# EAGLE design untitled (EAGLE 9.3.1)
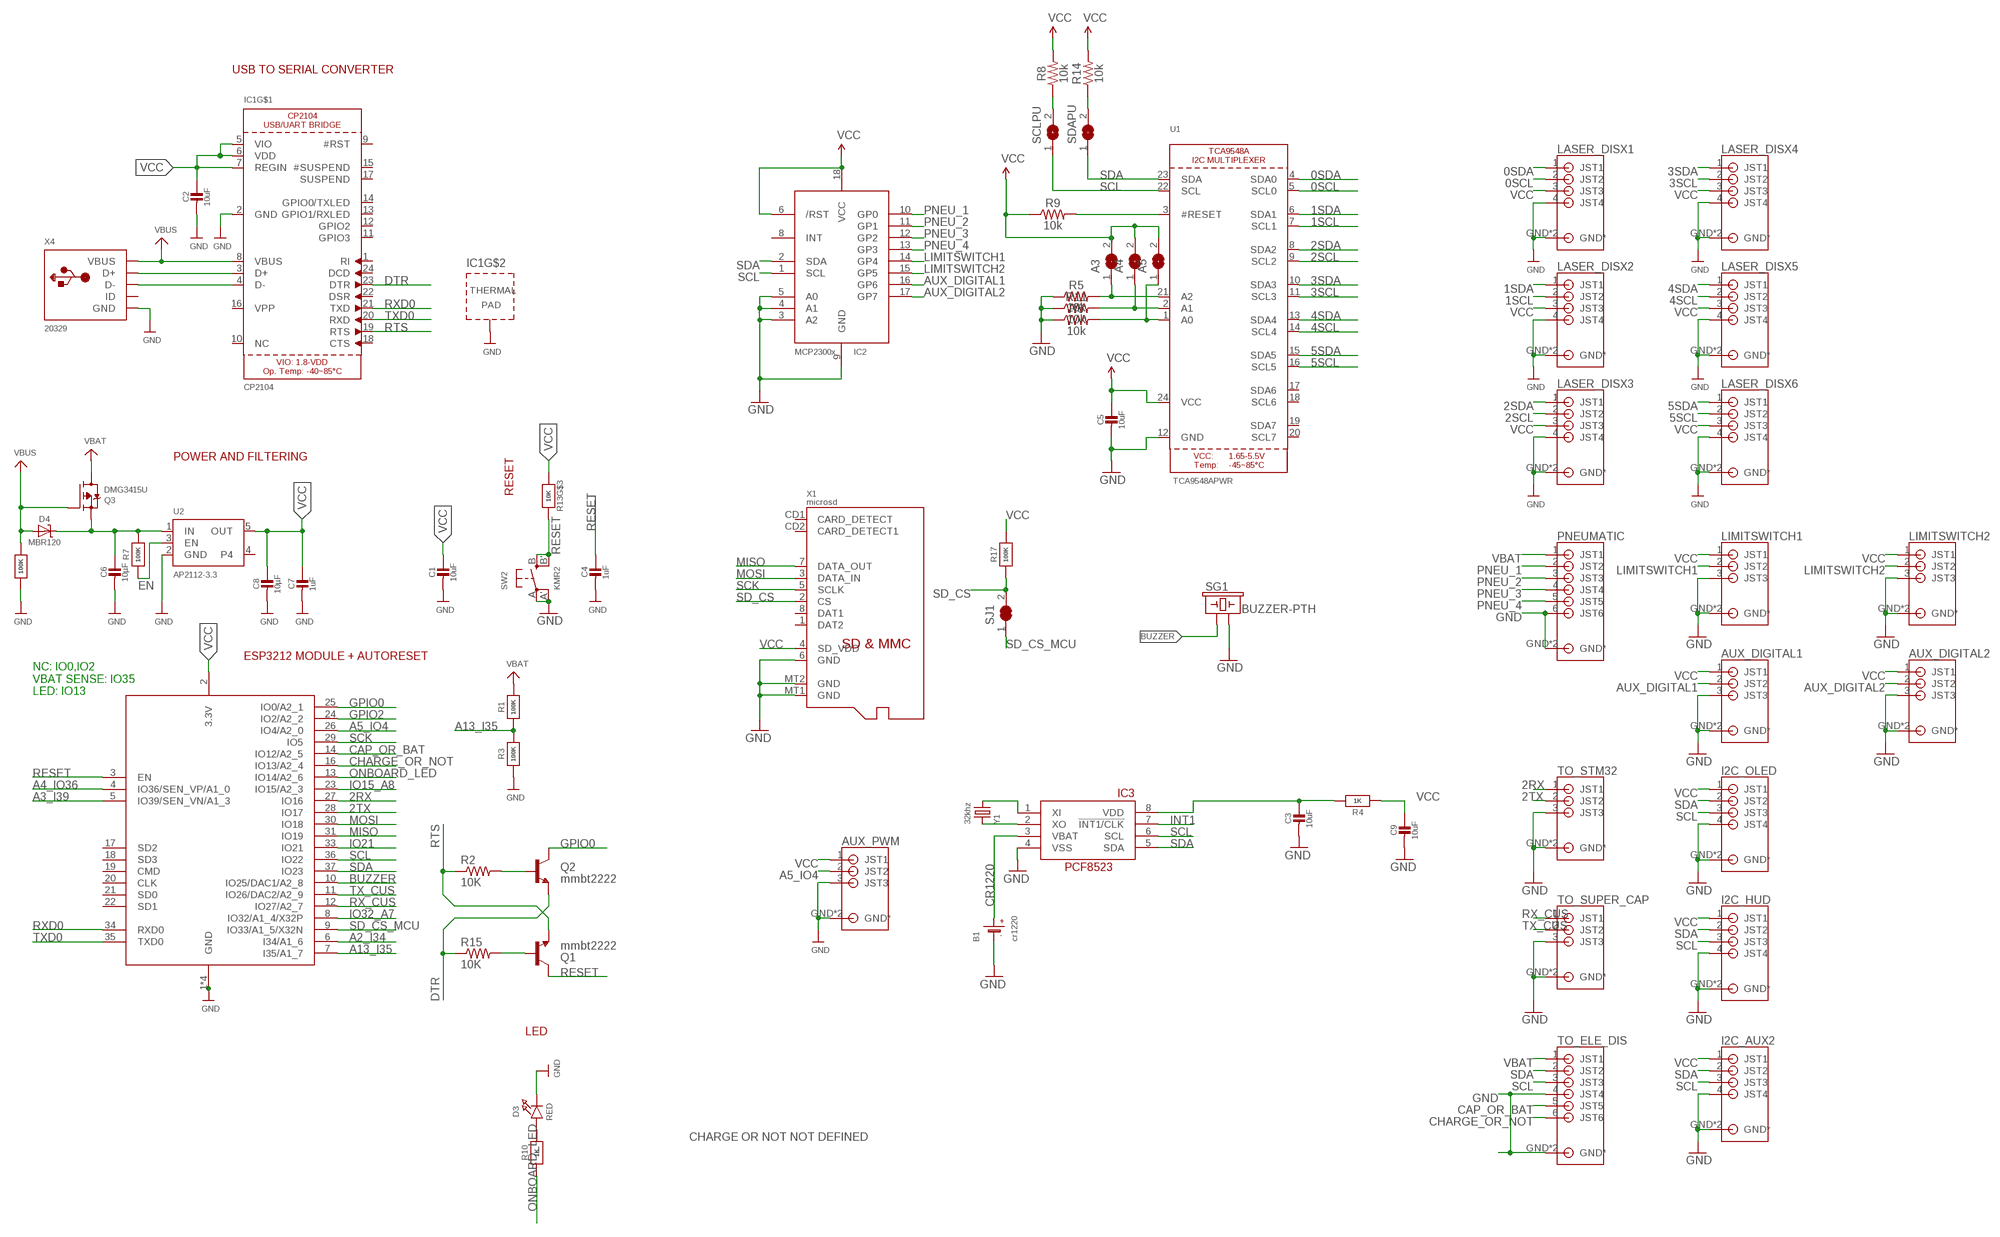
[diagram p0: schematic, sheet 1]

## Parts
A3  SOLDERJUMPER  [SOLDERJUMPER_ARROW_NOPASTE]
A4  SOLDERJUMPER  [SOLDERJUMPER_ARROW_NOPASTE]
A5  SOLDERJUMPER  [SOLDERJUMPER_ARROW_NOPASTE]
AUX_DIGITAL1  S3B-PH-SM4_TB  [S3B-PH-SM4_TB]
AUX_DIGITAL2  S3B-PH-SM4_TB  [S3B-PH-SM4_TB]
AUX_PWM  S3B-PH-SM4_TB  [S3B-PH-SM4_TB]
B1  cr1220  BATTERYCR1220_2  [CR1220-2]
C1  10uF  CAP_CERAMIC0805-NOOUTLINE  [0805-NO]
C2  10uF  CAP_CERAMIC0805-NOOUTLINE  [0805-NO]
C3  10uF  CAP_CERAMIC0805-NOOUTLINE  [0805-NO]
C4  1uF  CAP_CERAMIC0603_NO  [0603-NO]
C5  10uF  CAP_CERAMIC0805-NOOUTLINE  [0805-NO]
C6  10µF  CAP_CERAMIC0805-NOOUTLINE  [0805-NO]
C7  1uF  CAP_CERAMIC0603_NO  [0603-NO]
C8  10µF  CAP_CERAMIC0805-NOOUTLINE  [0805-NO]
C9  10uF  CAP_CERAMIC0805-NOOUTLINE  [0805-NO]
D3  RED  LED0805_NOOUTLINE  [CHIPLED_0805_NOOUTLINE]
D4  MBR120  DIODE-SCHOTTKYSOD-123  [SOD-123]
I2C_AUX2  S4B-PH-SM4_TB  [S4B-PH-SM4_TB]
I2C_HUD  S4B-PH-SM4_TB  [S4B-PH-SM4_TB]
I2C_OLED  S4B-PH-SM4_TB  [S4B-PH-SM4_TB]
IC1  CP2104  [QFN24_4MM_SMSC]
IC2  MCP23008/SO  [SO18W]
IC3  PCF8523T  RTC_PCF8523T  [SOIC8_150MIL]
LASER_DISX1  S4B-PH-SM4_TB  [S4B-PH-SM4_TB]
LASER_DISX2  S4B-PH-SM4_TB  [S4B-PH-SM4_TB]
LASER_DISX3  S4B-PH-SM4_TB  [S4B-PH-SM4_TB]
LASER_DISX4  S4B-PH-SM4_TB  [S4B-PH-SM4_TB]
LASER_DISX5  S4B-PH-SM4_TB  [S4B-PH-SM4_TB]
LASER_DISX6  S4B-PH-SM4_TB  [S4B-PH-SM4_TB]
LIMITSWITCH1  S3B-PH-SM4_TB  [S3B-PH-SM4_TB]
LIMITSWITCH2  S3B-PH-SM4_TB  [S3B-PH-SM4_TB]
PNEUMATIC  S6B-PH-SM4_TB  [S6B-PH-SM4_TB]
Q1  mmbt2222  TRANSISTOR_NPNSOT23-3  [SOT23-3]
Q2  mmbt2222  TRANSISTOR_NPNSOT23-3  [SOT23-3]
Q3  DMG3415U  MOSFET-P  [SOT23-R]
R1  100K  RESISTOR_0603_NOOUT  [0603-NO]
R2  10K  10KOHM-1/10W-1%(0603)0603  [0603-RES]
R3  100K  RESISTOR_0603_NOOUT  [0603-NO]
R4  1K  RESISTOR_0603_NOOUT  [0603-NO]
R5  10k  10KOHM-0603-1/10W-1%  [0603]
R6  10k  10KOHM-0603-1/10W-1%  [0603]
R7  100K  RESISTOR_0603_NOOUT  [0603-NO]
R8  10k  10KOHM-0603-1/10W-1%  [0603]
R9  10k  10KOHM-0603-1/10W-1%  [0603]
R10  1K  RESISTOR_0603_NOOUT  [0603-NO]
R11  10k  10KOHM-0603-1/10W-1%  [0603]
R12  100K  RESISTOR_0603_NOOUT  [0603-NO]
R13  10K  RESISTOR_4PACK  [RESPACK_4X0603]
R14  10k  10KOHM-0603-1/10W-1%  [0603]
R15  10K  10KOHM-1/10W-1%(0603)0603  [0603-RES]
R17  100K  RESISTOR_0603_NOOUT  [0603-NO]
SCLPU  SOLDERJUMPERCLOSED  [SOLDERJUMPER_CLOSEDWIRE]
SDAPU  SOLDERJUMPERCLOSED  [SOLDERJUMPER_CLOSEDWIRE]
SG1  BUZZER-PTH  [BUZZER-12MM]
SJ1  SOLDERJUMPER_CLOSED  [SOLDERJUMPER_CLOSEDWIRE]
SW2  KMR2  SWITCH_TACT_SMT4.6X2.8  [BTN_KMR2_4.6X2.8]
TO_ELE_DIS  S6B-PH-SM4_TB  [S6B-PH-SM4_TB]
TO_STM32  S3B-PH-SM4_TB  [S3B-PH-SM4_TB]
TO_SUPER_CAP  S3B-PH-SM4_TB  [S3B-PH-SM4_TB]
U1  TCA9548APWR  TCA9548A  [TSSOP24]
U2  AP2112-3.3  VREG_SOT23-5  [SOT23-5]
X1  microsd  MICROSD  [MICROSD]
X2  ESP32_WROOM32_SKINNY  [WROOM32_SKINNY]
X4  20329  USB_MICRO_20329_V2  [4UCONN_20329_V2]
Y1  32khz  CRYSTAL8.0X3.8  [CRYSTAL_8X3.8]

## Nets
0SCL: LASER_DISX1.2(JST2) U1.5(SCL0)
0SDA: LASER_DISX1.1(JST1) U1.4(SDA0)
1SCL: LASER_DISX2.2(JST2) U1.7(SCL1)
1SDA: LASER_DISX2.1(JST1) U1.6(SDA1)
2RX [sig]: TO_STM32.1(JST1) X2.27(IO16)
2SCL: LASER_DISX3.2(JST2) U1.9(SCL2)
2SDA: LASER_DISX3.1(JST1) U1.8(SDA2)
2TX [sig]: TO_STM32.2(JST2) X2.28(IO17)
3SCL: LASER_DISX4.2(JST2) U1.11(SCL3)
3SDA: LASER_DISX4.1(JST1) U1.10(SDA3)
4SCL: LASER_DISX5.2(JST2) U1.14(SCL4)
4SDA: LASER_DISX5.1(JST1) U1.13(SDA4)
5SCL: LASER_DISX6.2(JST2) U1.16(SCL5)
5SDA: LASER_DISX6.1(JST1) U1.15(SDA5)
A0: A5.1 R6.2 U1.1(A0)
A1: A4.1 R11.2 U1.2(A1)
A2: A3.1 R5.2 U1.21(A2)
A2_I34 [sig]: X2.6(I34/A1_6)
A3_I39 [sig]: X2.5(IO39/SEN_VN/A1_3)
A4_IO36 [sig]: X2.4(IO36/SEN_VP/A1_0)
A5_IO4 [sig]: AUX_PWM.2(JST2) X2.26(IO4/A2_0)
A13_I35 [sig]: R1.1 R3.2 X2.7(I35/A1_7)
AUX_DIGITAL1: AUX_DIGITAL1.2(JST2) IC2.16(GP6)
AUX_DIGITAL2: AUX_DIGITAL2.2(JST2) IC2.17(GP7)
BUZZER [sig]: SG1.+ X2.10(IO25/DAC1/A2_8)
CAP_OR_BAT: TO_ELE_DIS.5(JST5) X2.14(IO12/A2_5)
CHARGE_OR_NOT: TO_ELE_DIS.6(JST6) X2.16(IO13/A2_4)
CR1220: B1.+ IC3.3(VBAT)
DTR: IC1.23(DTR) Q2.2(E) R15.1
EN: R7.1 U2.3(EN)
GND: AUX_DIGITAL1.3(JST3) AUX_DIGITAL1.GND2(GND*) AUX_DIGITAL1.GND(GND*) AUX_DIGITAL2.3(JST3) AUX_DIGITAL2.GND2(GND*) AUX_DIGITAL2.GND(GND*) AUX_PWM.3(JST3) AUX_PWM.GND2(GND*) AUX_PWM.GND(GND*) B1.- C1.2 C2.2 C3.2 C4.2 C5.2 C6.2 C7.2 C8.2 C9.2 D3.C I2C_AUX2.4(JST4) I2C_AUX2.GND2(GND*) I2C_AUX2.GND(GND*) I2C_HUD.4(JST4) I2C_HUD.GND2(GND*) I2C_HUD.GND(GND*) I2C_OLED.4(JST4) I2C_OLED.GND2(GND*) I2C_OLED.GND(GND*) IC1.2(GND) IC1.THERM(TP) IC2.3(A2) IC2.4(A1) IC2.5(A0) IC2.9(GND) IC3.4(VSS) LASER_DISX1.4(JST4) LASER_DISX1.GND2(GND*) LASER_DISX1.GND(GND*) LASER_DISX2.4(JST4) LASER_DISX2.GND2(GND*) LASER_DISX2.GND(GND*) LASER_DISX3.4(JST4) LASER_DISX3.GND2(GND*) LASER_DISX3.GND(GND*) LASER_DISX4.4(JST4) LASER_DISX4.GND2(GND*) LASER_DISX4.GND(GND*) LASER_DISX5.4(JST4) LASER_DISX5.GND2(GND*) LASER_DISX5.GND(GND*) LASER_DISX6.4(JST4) LASER_DISX6.GND2(GND*) LASER_DISX6.GND(GND*) LIMITSWITCH1.3(JST3) LIMITSWITCH1.GND2(GND*) LIMITSWITCH1.GND(GND*) LIMITSWITCH2.3(JST3) LIMITSWITCH2.GND2(GND*) LIMITSWITCH2.GND(GND*) PNEUMATIC.6(JST6) PNEUMATIC.GND2(GND*) PNEUMATIC.GND(GND*) R3.1 R5.1 R6.1 R11.1 R12.1 SG1.- SW2.A'(P1) SW2.A(P) TO_ELE_DIS.4(JST4) TO_ELE_DIS.GND2(GND*) TO_ELE_DIS.GND(GND*) TO_STM32.3(JST3) TO_STM32.GND2(GND*) TO_STM32.GND(GND*) TO_SUPER_CAP.3(JST3) TO_SUPER_CAP.GND2(GND*) TO_SUPER_CAP.GND(GND*) U1.12(GND) U2.2(GND) X1.6(GND) X1.MT1(GND) X1.MT2(GND) X2.1(GND) X2.15(GND) X2.38(GND) X2.P$1(GND) X4.BASE@1(GND) X4.BASE@2(GND) X4.GND X4.SPRT@1(GND) X4.SPRT@2(GND) X4.SPRT@3(GND) X4.SPRT@4(GND)
GPIO0: Q2.3(C) X2.25(IO0/A2_1)
GPIO2 [sig]: X2.24(IO2/A2_2)
INT1: IC3.7(!INT1/CLK)
IO15_A8 [sig]: X2.23(IO15/A2_3)
IO21 [sig]: X2.33(IO21)
IO32_A7 [sig]: X2.8(IO32/A1_4/X32P)
LIMITSWITCH1: IC2.14(GP4) LIMITSWITCH1.2(JST2)
LIMITSWITCH2: IC2.15(GP5) LIMITSWITCH2.2(JST2)
MISO [sig]: X1.7(DATA_OUT) X2.31(IO19)
MOSI [sig]: X1.3(DATA_IN) X2.30(IO18)
N$1: IC3.1(XI) Y1.P$4
N$2: IC1.3(D+) X4.D+
N$3: IC3.2(XO) Y1.P$1
N$4: C3.1 IC3.8(VDD) R4.2
N$5: D3.A R10.2
N$6: IC1.4(D-) X4.D-
N$7: C6.1 D4.C Q3.2(S) R7.2 U2.1(IN)
N$8: R8.1 SCLPU.2
N$9: R14.1 SDAPU.2
N$10: R9.2 U1.3(#RESET)
N$12: Q1.1(B) R15.2
N$13: Q2.1(B) R2.2
ONBOARD_LED [sig]: R10.1 X2.13(IO14/A2_6)
PNEU_1: IC2.10(GP0) PNEUMATIC.2(JST2)
PNEU_2: IC2.11(GP1) PNEUMATIC.3(JST3)
PNEU_3: IC2.12(GP2) PNEUMATIC.4(JST4)
PNEU_4: IC2.13(GP3) PNEUMATIC.5(JST5)
RESET [sig]: C4.1 Q1.3(C) R13.6 SW2.B'(S1) SW2.B(S) X2.3(EN)
RTS: IC1.19(RTS) Q1.2(E) R2.1
RX_CUS [sig]: TO_SUPER_CAP.1(JST1) X2.12(IO27/A2_7)
RXD0 [sig]: IC1.21(TXD) X2.34(RXD0)
SCK [sig]: X1.5(SCLK) X2.29(IO5)
SCL [sig]: I2C_AUX2.3(JST3) I2C_HUD.3(JST3) I2C_OLED.3(JST3) IC2.1(SCL) IC3.6(SCL) SCLPU.1 TO_ELE_DIS.3(JST3) U1.22(SCL) X2.36(IO22)
SD_CS: R17.1 SJ1.2 X1.2(CS)
SD_CS_MCU [sig]: SJ1.1 X2.9(IO33/A1_5/X32N)
SDA [sig]: I2C_AUX2.2(JST2) I2C_HUD.2(JST2) I2C_OLED.2(JST2) IC2.2(SDA) IC3.5(SDA) SDAPU.1 TO_ELE_DIS.2(JST2) U1.23(SDA) X2.37(IO23)
TX_CUS [sig]: TO_SUPER_CAP.2(JST2) X2.11(IO26/DAC2/A2_9)
TXD0 [sig]: IC1.20(RXD) X2.35(TXD0)
VBAT: PNEUMATIC.1(JST1) Q3.3(D) R1.2 TO_ELE_DIS.1(JST1)
VBUS: D4.A IC1.8(VBUS) Q3.1(G) R12.2 X4.VBUS
VCC: A3.2 A4.2 A5.2 AUX_DIGITAL1.1(JST1) AUX_DIGITAL2.1(JST1) AUX_PWM.1(JST1) C1.1 C2.1 C5.1 C7.1 C8.1 C9.1 I2C_AUX2.1(JST1) I2C_HUD.1(JST1) I2C_OLED.1(JST1) IC1.5(VIO) IC1.6(VDD) IC1.7(REGIN) IC2.6(/RST) IC2.18(VCC) LASER_DISX1.3(JST3) LASER_DISX2.3(JST3) LASER_DISX3.3(JST3) LASER_DISX4.3(JST3) LASER_DISX5.3(JST3) LASER_DISX6.3(JST3) LIMITSWITCH1.1(JST1) LIMITSWITCH2.1(JST1) R4.1 R8.2 R9.1 R13.3 R14.2 R17.2 U1.24(VCC) U2.5(OUT) X1.4(SD_VDD) X2.2(3.3V)
Unconnected: IC1.1(RI) IC1.9(#RST) IC1.10(NC) IC1.11(GPIO3) IC1.12(GPIO2) IC1.13(GPIO1/RXLED) IC1.14(GPIO0/TXLED) IC1.15(#SUSPEND) IC1.16(VPP) IC1.17(SUSPEND) IC1.18(CTS) IC1.22(DSR) IC1.24(DCD) IC2.8(INT) R13.1 R13.2 R13.4 R13.5 R13.7 R13.8 U1.17(SDA6) U1.18(SCL6) U1.19(SDA7) U1.20(SCL7) U2.4 X1.1(DAT2) X1.8(DAT1) X1.CD1(CARD_DETECT) X1.CD2(CARD_DETECT1) X2.17(SD2) X2.18(SD3) X2.19(CMD) X2.20(CLK) X2.21(SD0) X2.22(SD1) X4.ID

## Notes on the sheet
- USB TO SERIAL CONVERTER
- POWER AND FILTERING
- RESET
- ESP3212 MODULE + AUTORESET
- NC: IO0,IO2
  VBAT SENSE: IO35
  LED: IO13
- LED
- CHARGE OR NOT NOT DEFINED

## Library data of the parts
A3-A5 = microbuilder:SOLDERJUMPER: SMD Solder JUMPER Solder the two pads together to create a connection, or remove the solder to break it. REFLOW - Use this footprint for solder paste and reflow ovens. WAVE - Use this footprint for hand-soldering (larger pads). CLOSED - Has a trace between the two pads to ensure it is closed by default. The trace needs to be cut to disable the jumper, and can be closed again by creating a solder bridge between the two pads.; BOM: EXCLUDE
AUX_DIGITAL1 AUX_DIGITAL2 AUX_PWM LIMITSWITCH1 LIMITSWITCH2 TO_STM32 TO_SUPER_CAP = NewKevinMade:S3B-PH-SM4_TB
B1 = microbuilder:BATTERY: CR1220 SMT - Digikey: 3001K-ND CD2032 BAT-HLD-001 - Digikey: BAT-HLD-001-ND
C1-C9 = microbuilder:CAP_CERAMIC: Ceramic Capacitors For new designs, use the packages preceded by an '_' character since they are more reliable: The following footprints should be used on most boards: _0402 - Standard footprint for regular board layouts _0603 - Standard footprint for regular board layouts _0805 - Standard footprint for regular board layouts _1206 - Standard footprint for regular board layouts For extremely tight-pitch boards where space is at a premium, the following 'micro-pitch' footprints can be used (smaller pads, no silkscreen outline, etc.): _0402MP - Micro-pitch footprint for very dense/compact boards _0603MP - Micro-pitch footprint for very dense/compact boards _0805MP - Micro-pitch footprint for very dense/compact boards _1206MP - Micro-pitch footprint for very dense/compact boards
D3 = microbuilder:LED: LED 0603 - 0603 Surface Mount Package 2mA: Green LED - Low Power (3.9mcd, 2ma, 1.7Vf) - Digikey: 475-2709-2-ND Orange LED - Low Power (9.8mcd, 2ma, 1.8Vf) - Digikey: 475-1194-2-ND Red LED - Low Power (5mcd, 2ma, 1.8Vf) - Digikey: 475-1195-2-ND Yellow LED - Low Power (7mcd, 2ma, 1.8Vf) - Digikey: 475-1196-2-ND 5mA: Blue LED - Low Power (17mcd, 5ma, 2.9Vf) - Digikey: LNJ937W8CRACT-ND 0805 - 0805 Surface Mount Package 2mA: Red LED (8.8mcd, 2mA, 1.8Vf, Clear) - Low Power [Digikey: 475-2510-1-ND] Green LED (5mcd, 2mA, 1.8Vf, Clear) - Low Power [Digikey: 475-2730-1-ND] Yellow LED (11.3mcd, 2mA, 1.8Vf, Clear) - Low Power [Digikey: 475-2555-1-ND] 20mA: Red LED (104mcd, 20mA, Diffused) - LS R976 [Digikey: 475-1278-6-ND] Red LED (12mcd, 20mA, 2.0Vf, Clear) - APT2012EC [Digikey: 754-1128-1-ND] Green LED (15mcd, 20mA, 2.2Vf, Clear) - APT2012GC [Digikey: 754-1131-1-ND] Orange LED (160mcd, 20mA, 2.1Vf, Clear) - APT2012SECK [Digikey: 754-1130-1-ND] 1206 - 1206 Surface Mount Package Green LED (26mcd, 20mA, Diffused) - LG N971 [Digikey: 475-1407-6-ND] Red LED (15mcd, 20mA, Diffused) - LH N974 [Digikey: 475-1416-6-ND] Cree - Cree High-Power Surface Mount LEDs XPEBWT-L1-0000-00D50 - White 111lm 350mA 2.9Vf 6200K 110° XTEAWT-00-0000-00000LEE3 - White 114lm 350mA 2.85Vf 5000K 115° Everlight - Everlight 45-21 Series Surface Mount LEDs 45-21/QK2C-B2832AC2CB2/2T - Warm White 2000mcd 20mA 3.25Vf 3050K 120° 45-21/LK2C-B38452C4CB2/2T - Nuetral White 2000mcd 20mA 3.25Vf 4150K 120° 45-21/LK2C-B50634C6CB2/2T - Cold White 2200mcd 20mA 3.25Vf 5650K 120° PLCC2 Reverse Mount LS T77K-J1L2-1-0-2-R18-Z - Red 11.25mcd 2mA 1.8Vf 630nm 120° LO T77K-L1M2-24-Z - Orange 19.6mcd 2mA 1.8Vf 606nm 120° LY T77K-K2M1-26-Z - Yellow 15.7mcd 2mA 1.8Vf 587nm 120°
D4 = microbuilder:DIODE-SCHOTTKY
I2C_AUX2 I2C_HUD I2C_OLED = NewKevinMade:S4B-PH-SM4_TB
IC1 = microbuilder:CP2104: CP2104 - USB to UART Bridge VDD Output: 3.45V
IC2 = adafruit:MCP23008: MCP23008 Inexpensive i2c i/o expander - 8 general purpose i/o pins with optional pullups
IC3 = microbuilder:RTC_PCF8523
LASER_DISX1-LASER_DISX6 = KevinMade:S4B-PH-SM4_TB
PNEUMATIC TO_ELE_DIS = NewKevinMade:S6B-PH-SM4_TB
Q1 Q2 = SparkFun:TRANSISTOR_NPN: Transistor NPN BJT configuration in SOT23 package. MMBT2222 is the common NPN we use. Double check BCE configuration again layout.
Q3 = microbuilder:MOSFET-P: P-Channel Mosfet LEGEND VDS: Voltage Drain-Source ID: Drain Current RDS(ON): Drain-Source On-State Resistance VGS(TH): Gate-Source Threshold Voltage CISS: Drain-Source Input Capacitance SOT-23 Name VDS ID RDS(ON) VGS(TH) CISS Order Number IRLML5103 30V 760mA 600 mOhm -- 75pF @ 25V Digikey: IRLML5103PBFCT-ND IRLML6401 12V 4.3A 50 mOhm 950mV @ 250µA 830pF @ 10V Digikey: IRLML6401PBFTR-ND NTR0202PL 20V 400mA 800 mOhm 2.3V @ 250uA 70pF @ 5V Digikey: NTR0202PLT1GOSTR-ND NTR4101PT1G 20V 1.8A 85 mOhm 1.2V @ 250uA 675pF @ 10V Digikey: NTR4101PT1GOSCT-ND DMP2004K 20V 600mA 900 mOhm 1V @ 250uA 175pF @ 16V Digikey: DMP2004KDICT-ND PMV65XP 20V 3.9A 76 mOhm 950mV @ 1mA 725pF @ 20V Digikey: 568-2358-2-ND TO-252 Name VDS ID RDS(ON) VGS(TH) CISS Order Number AOD417 30V 25A 34 mOhm 3V @ 250µA 920pF @ 15V Digikey: 785-1106-2-ND PowerPak Name VDS ID RDS(ON) VGS(TH) CISS Order Number AON7401 30V 12A 14 mOhm 3V @ 250µA 2600pF @ 15V Digikey: 785-1302-1-ND
R1 R3 R4 R7 R10 R12 R17 = microbuilder:RESISTOR: Resistors For new designs, use the packages preceded by an '_' character since they are more reliable: The following footprints should be used on most boards: _0402 - Standard footprint for regular board layouts _0603 - Standard footprint for regular board layouts _0805 - Standard footprint for regular board layouts _1206 - Standard footprint for regular board layouts For extremely tight-pitch boards where space is at a premium, the following 'micro-pitch' footprints can be used (smaller pads, no silkscreen outline, etc.): _0402MP - Micro-pitch footprint for very dense/compact boards _0603MP - Micro-pitch footprint for very dense/compact boards _0805MP - Micro-pitch footprint for very dense/compact boards _1206MP - Micro-pitch footprint for very dense/compact boards
R2 R15 = SparkFun-Resistors:10KOHM-1/10W-1%(0603): RES-00824; PROD_ID: RES-00824
R5 R6 R8 R9 R11 R14 = SparkFun-Resistors:10KOHM: 10kΩ resistor A resistor is a passive two-terminal electrical component that implements electrical resistance as a circuit element. Resistors act to reduce current flow, and, at the same time, act to lower voltage levels within circuits. - Wikipedia; PROD_ID: RES-00824
R13 = microbuilder:RESISTOR_4PACK: Resistor Packs (4 resistors) 4 x 0603 10K 1/16W - Digikey: YC164J-10KCT-ND
SCLPU SDAPU = microbuilder:SOLDERJUMPER: SMD Solder JUMPER Solder the two pads together to create a connection, or remove the solder to break it. REFLOW - Use this footprint for solder paste and reflow ovens. WAVE - Use this footprint for hand-soldering (larger pads). CLOSED - Has a trace between the two pads to ensure it is closed by default. The trace needs to be cut to disable the jumper, and can be closed again by creating a solder bridge between the two pads.
SG1 = SparkFun-Electromechanical:BUZZER: Buzzer Small round buzzers that operate around the audible 2kHz range. You can use these as speakers to create simple music or user interfaces. Variant Overview: PTH - Mini Speaker - PC Mount 12mm 2.048kHz <https://www.sparkfun.com/products/7950> PTH_KIT - Mini Speaker - PC Mount 12mm 2.048kHz <https://www.sparkfun.com/products/7950> KIT simplifies soldering by adding stop mask to one side of the pads. PTH_NO_SILK - Mini Speaker - PC Mount 12mm 2.048kHz <https://www.sparkfun.com/products/7950> No silkscreen indicator of buzzer outline. PTH_KIT_NO_SILK - Mini Speaker - PC Mount 12mm 2.048kHz <https://www.sparkfun.com/products/7950> KIT package w/o silkscreen SMD - Buzzer Audio Magnetic (CCV-084B16) SMD buzzer used on, e.g. the LilyPad Buzzer <https://www.sparkfun.com/products/8463> and RFID USB Reader <https://www.sparkfun.com/products/9963>. SMD_KIT - Buzzer Audio Magnetic (CCV-084B16) SMD Buzzer with elongated pins to make soldering easier. Used on the SparkFun Simon Says - Surface Mount Soldering Kit <https://www.sparkfun.com/products/10935>.; PROD_ID: COMP-08253; SF_SKU: COM-07950
SJ1 = microbuilder:SOLDERJUMPER_CLOSED: Solder Jumper - Closed These solder jumpers are closed by default CLOSEDWIRE - 10 mil trace between pads that can be cut and resoldered later CLOSEDPERM - 63 mil trace between pads for a permanent connection (used to 'bridge' two signals, a shameless hack for Eagle). Can double as a test point as well (no cream layer)
SW2 = microbuilder:SWITCH_TACT_SMT: SMT Tact Switches 6x6mm - Digikey: P12940SCT-ND KMR2 (4.6x2.8mm) - Digikey: 401-1426-1-ND EVQ-PQHB55 - Light Touch, 160GF (4.5x4.5mm) - Digikey: P8090SCT-ND KMT0 - KMT021 NGJ LHS (etc.) IP68/Waterproof - Digikey: CKN10289CT-ND
U1 = microbuilder:TCA9548A: TCA9548A I2C Multiplexer
U2 = microbuilder:VREG_SOT23-5: SOT23-5 Fixed Voltage Regulators Part Current Out V Out V In V Dropout θJA (°C/W) TJ (°C) Digikey Part No. ADP121 150mA 3.3V 3.4-5.5V 0.09V @ 150mA -- -- ADP121-AUJZ33R7CT-ND ADP121 150mA 3.0V 3.1-5.5V 0.09V @ 150mA -- -- ADP121-AUJZ30R7CT-ND ADP122 300mA 3.3V 3.4-5.5V 0.085V @ 300mA -- -- ADP122AUJZ-3.3-R7CT-ND ADP1712 300mA 3.3V 3.5-5.5V 0.17V @ 300mA -- -- ADP1712AUJZ-3.3-R7TR-ND AP7311 (Low Cost) 150mA 3.3V 3.5-6V 0.15V @ 150mA -- -- AP7311-33WG-7DICT-ND LD39015M18R 150mA 1.8V 1.9V-5.5V 0.08V @ 100mA -- -- 497-6977-1-ND LP2985A-33DBVR 150mA 3.3V 3.3-16V 0.28V @ 150mA 206 150 296-18479-1-ND MCP1824T-3302E/OT 300mA 3.3V 3.5V-6V 0.2V @ 300mA -- -- MCP1824T-3302E/OTCT-ND MIC5205-2.5YM5 TR 150mA 2.5V 2.7-16V 0.165V @ 150mA -- -- 576-1257-2-ND MIC5205-3.0YM5 TR 150mA 3.0V 3.2V-16V 0.165V @ 150mA -- -- 576-1258-2-ND MIC5205-3.3YM5 TR 150mA 3.3V 3.5V-16V 0.165V @ 150mA -- -- 576-1259-2-ND TPS780330220 150mA 3.3V+2.2V 3.6-5.5V 250mV Max -- -- 296-23332-1-ND TDA3663/N1,135 100mA 3.3V 3.5-45V 0.18V @ 50mA -- -- 568-5343-1-ND Max operating temp can be calculated using θJA, TJ (max junction temperature), and power in watts. Set the "Maximum Ambient Temperature" until it reaches TJ ("Max Junction Temperature"), which is the absolute limit for safe use of the regulator: Heat Sink Temperature Calculator <http://www.daycounter.com/Calculators/Heat-Sink-Temperature-Calculator.phtml> For example, With 12V source into a 3.3V LP2985 and a 30mA load, we are dissipating (12V-3.3V) * 0.03A = 0.261W. With a θJA of 206 °C/W, a TJ of 150°C, and 261mW we can safely use the chip without a heat sink up to 75°C (=147.1°C Junction Temperature).
X1 = microbuilder:MICROSD: MicroSD/Transflash Card Holder with SPI pinout 3M: 2908-05WB-MG 4UConnector: 19656 Footprint courtesy: Adafruit Industries
X2 = microbuilder:ESP32_WROOM32
X4 = microbuilder:USB: USB Connectors USBMINIB - Surface Mount Female Mini-B USB Connector 4UConnector: 06564
Y1 = microbuilder:CRYSTAL: Crystals HC49UP - Surface Mount Crystal 4.0MHz 18pF +/-30ppm Surface Mount Crystal [Digikey: 535-9857-1-ND] 12.0 MHz Surface Mount Crystal [Digikey: 535-9869-6-ND] 25.0 MHz Surface Mount Crystal [Digikey: 535-9078-1-ND] 2.5 x 2.0mm - MEMs SMT Crystal 16.0 MHz 10pF 20ppm 2.5 x 2.0mm Crystal [Digikey -40-85°C: 535-10923-1-ND] 3.2 x 2.5mm - MEMs SMT Crystal 12.0 MHz 8pF 15ppm 3.2 x 2.5mm Crystal [Digikey: -10-70°C: 644-1047-1-ND -40-125°C: 644-1128-1-ND] 40~85°C cheaper: 644-1173-6-ND 16.0 MHz 8pF 15ppm 3.2 x 2.5mm Crystal [Digikey: -10-70°C: 644-1049-1-ND -40-125°C: 644-1129-2-ND]-40~85°C cheaper: 644-1175-6-ND 16.0 MHz 10pF 10ppm 3.2 x 2.5mm Crystal [Digikey: 644-1100-1-ND] 27.12 MHz 18pF 30ppm 3.2 x 2.5mm Crystal [Digikey: 887-1424-1-ND] 27.12MHz 10pF 10ppm 3.2 x 2.5mm Crystal [Digikey: 887-1329-1-ND] 4.9 x 1.8mm - MEMs SMT Crystal 32.768 KHz 12.5pF 20ppm 4.9 x 1.8mm Crystal [Digikey: SE2415CT-ND] 8.0 x 3.8mm - Surface Mount Crystal 32.768kHz 12.5pF 20ppm -40°C-85°C [Digikey: 535-9166-2-ND] Cylinder 32.768KHz Cylinder Crystal (2x6mm body) [Ex. Digikey: 300-8341-2-ND]

## Net classes
0 default: width 0.305 mm, drill 0.305 mm, clearance 0.254 mm
1 sig: width 0.203 mm, drill 0.203 mm, clearance 0.203 mm

## Board
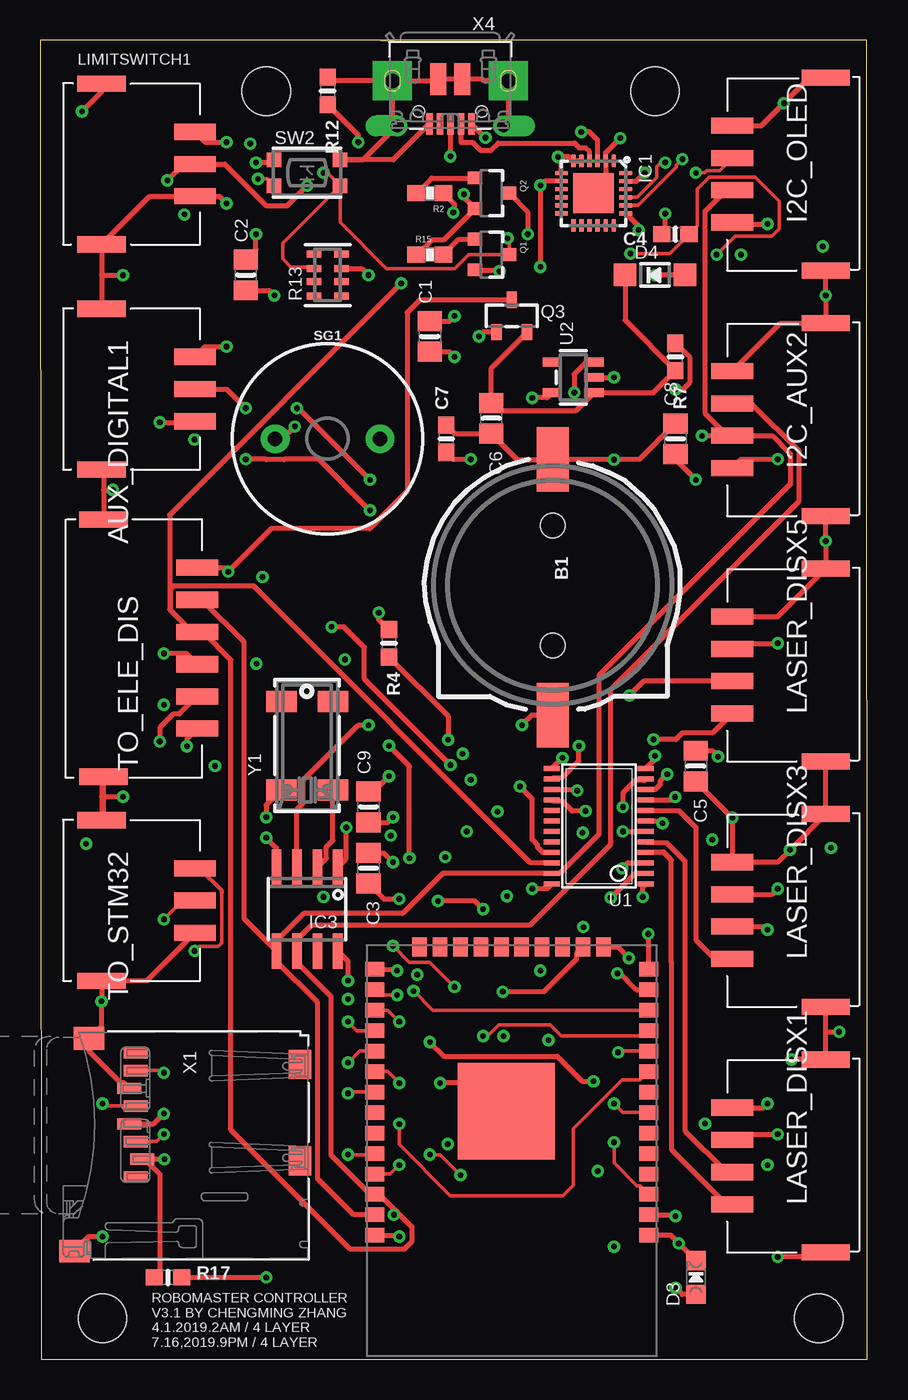
[diagram p1: board, top side]
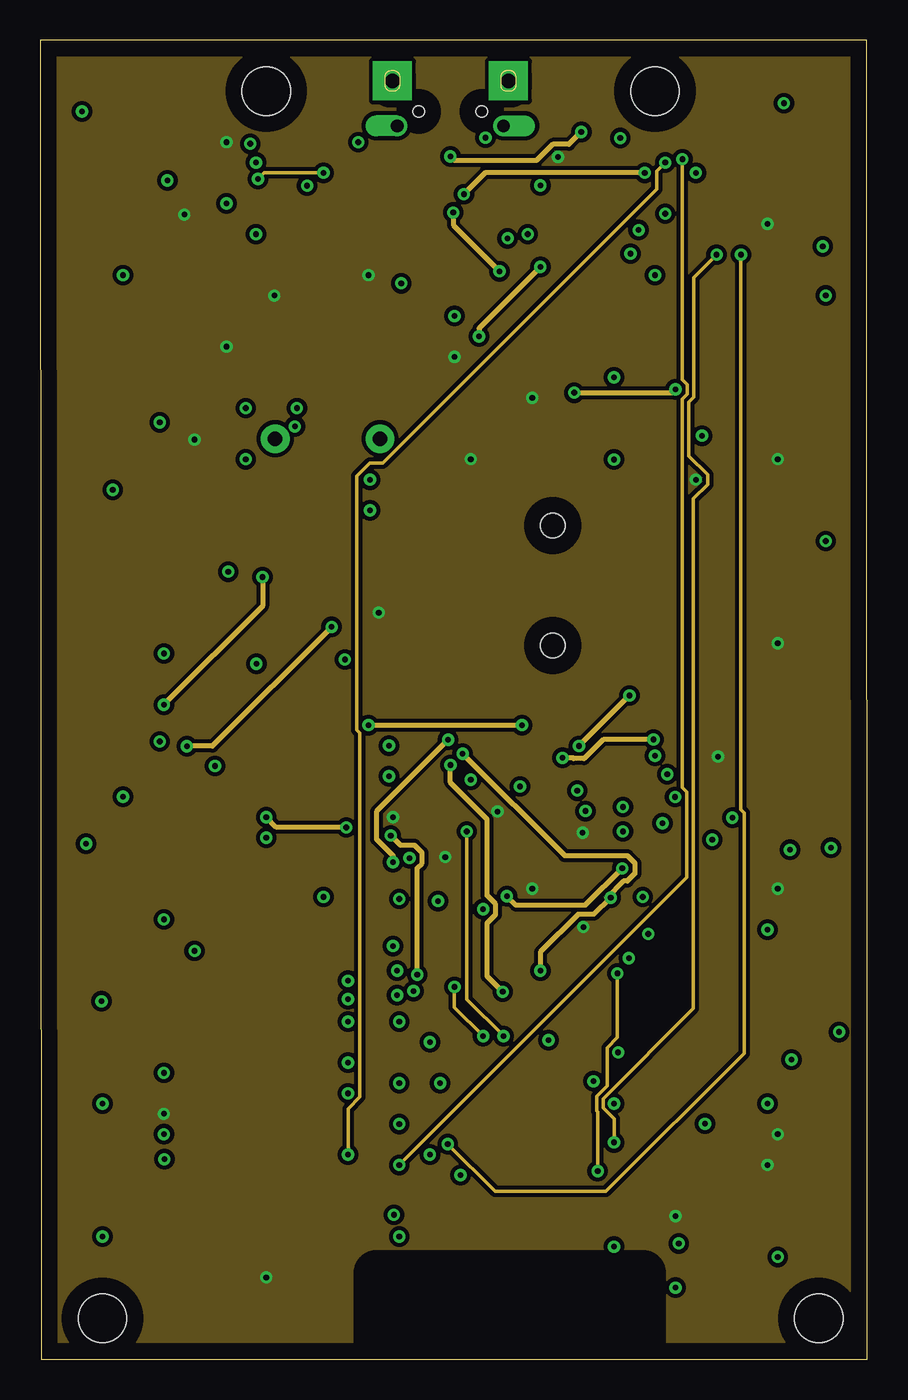
[diagram p2: board, inner layer Route2]
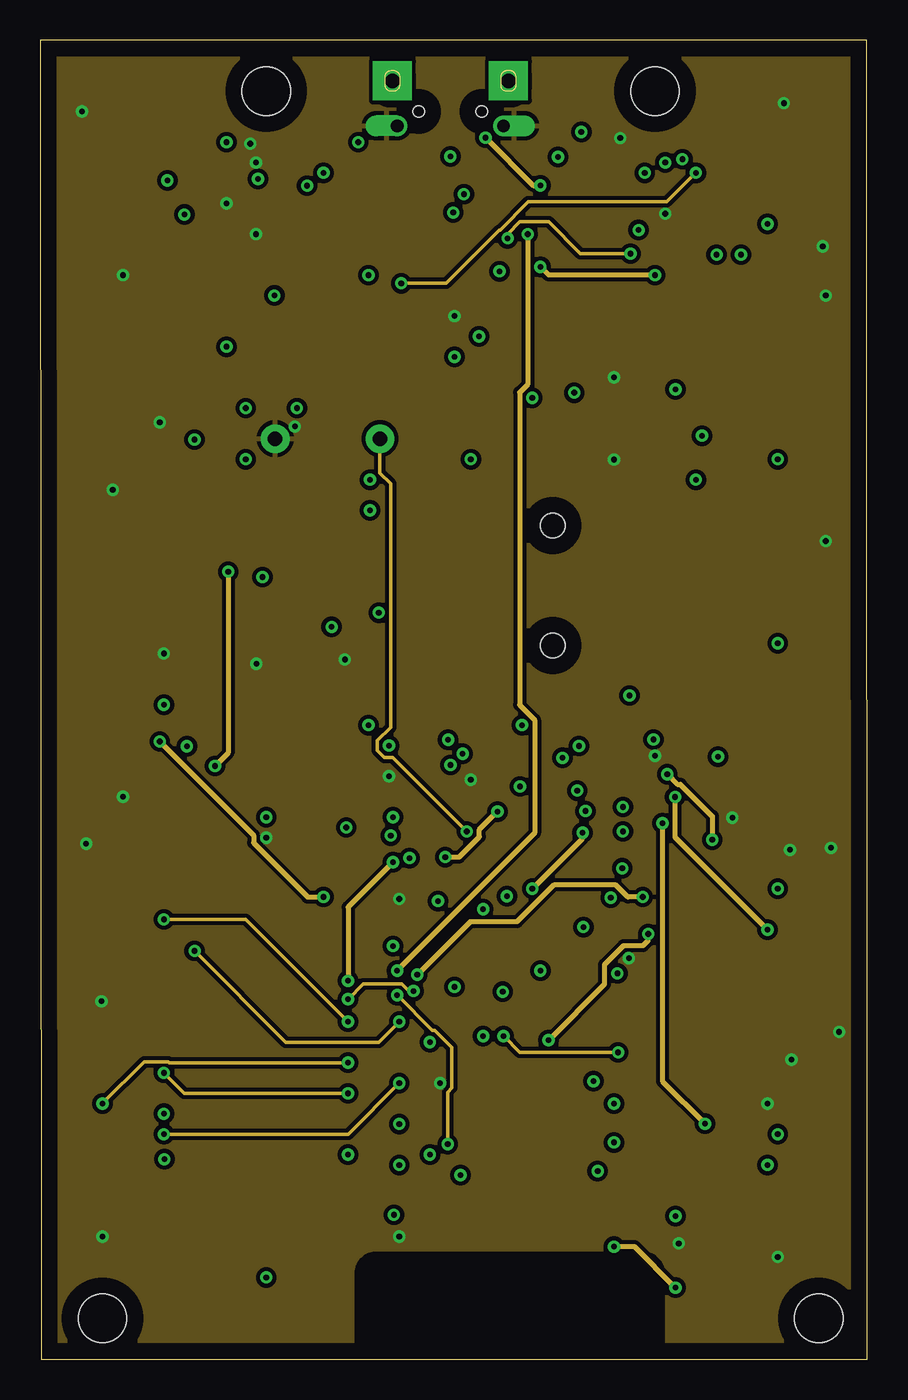
[diagram p3: board, inner layer Route15]
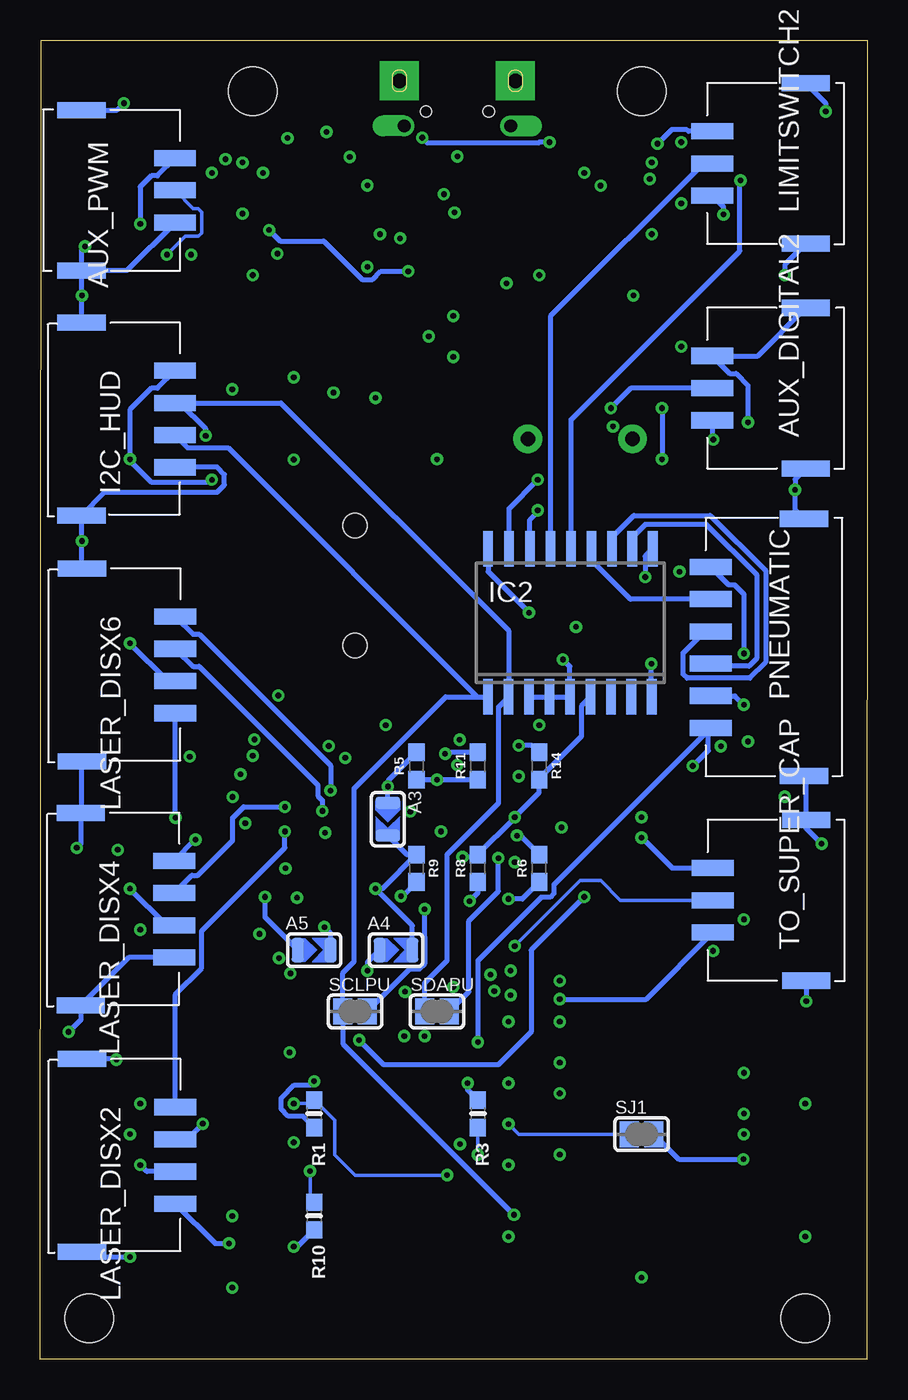
[diagram p4: board, bottom side, seen from below]

Size 51.34 x 81.89 mm. Coordinates in mm from the lower left corner, seen from the top.
Outline: 0.05,0 51.34,0 51.29,81.89 0,81.89 0.05,0
Copper layers (1+2*15+16): Top 0.035mm / dielectric 1.1mm / Route2 0.035mm / dielectric 0.15mm / Route15 0.035mm / dielectric 0.2mm / Bottom 0.035mm
Design rules "default *": minimum track width 6mil, minimum drill 0.35mm, track to track 6mil, track to pad 6mil, pad to pad 6mil, via to via 6mil, smd to smd 6mil, copper to edge 40mil, drill to drill 6mil, minimum pad ring 10mil, minimum via ring 8mil, stop-mask expansion 4mil, vias tented up to drill 14mil, thermal gap 10mil
Holes 3 mm at 3.86,2.54 48.31,2.54 14.02,78.74 38.15,78.74

### Footprints (pad centres in the part's own frame; a part is rotated, then mirrored left to right if it is on the bottom)
SOLDERJUMPER_ARROW_NOPASTE = smd 0.762 x 1.524: 1 -1.016,0; 2 1.016,0
S3B-PH-SM4_TB = smd 1 x 2.6: 1 3.81,8.28; 2 5.81,8.28; 3 7.81,8.28 | smd 1 x 3: GND 0.826,2.48; GND2 10.794,2.48
CR1220-2 = smd 4 x 2: + 8.29,0; - -7.6,0 | hole 1.5: 3.95,0; -3.5,0
0805-NO = smd 1.24 x 1.5: 1 -0.95,0; 2 0.95,0
0603-NO = smd 1.075 x 1: 1 -0.85,0; 2 0.85,0
CHIPLED_0805_NOOUTLINE = smd 1.2 x 1.2: A 0,-1.05; C 0,1.05
SOD-123 = smd 1.4 x 1.4: A 1.85,0; C -1.85,0
S4B-PH-SM4_TB = smd 1 x 2.6: 1 3.27,7.9; 2 5.27,7.9; 3 7.27,7.9; 4 9.27,7.9 | smd 1 x 3: GND 0.286,2.1; GND2 12.254,2.1
QFN24_4MM_SMSC = smd 0.8 x 0.28: 1 -2,1.25; 2 -2,0.75; 3 -2,0.25; 4 -2,-0.25; 5 -2,-0.75; 6 -2,-1.25; 13 2,-1.25; 14 2,-0.75; 15 2,-0.25; 16 2,0.25; 17 2,0.75; 18 2,1.25 | smd 0.28 x 0.8: 7 -1.25,-2; 8 -0.75,-2; 9 -0.25,-2; 10 0.25,-2; 11 0.75,-2; 12 1.25,-2; 19 1.25,2; 20 0.75,2; 21 0.25,2; 22 -0.25,2; 23 -0.75,2; 24 -1.25,2 | smd 2.5 x 2.5: THERM 0,0
SO18W = smd 0.6 x 2.2: 1 -4.445,-4.6; 2 -3.175,-4.6; 3 -1.905,-4.6; 4 -0.635,-4.6; 5 0.635,-4.6; 6 1.905,-4.6; 7 3.175,-4.6; 8 4.445,-4.6; 9 5.715,-4.6; 10 5.775,4.6; 11 4.505,4.6; 12 3.235,4.6; 13 1.965,4.6; 14 0.695,4.6; 15 -0.575,4.6; 16 -1.845,4.6; 17 -3.145,4.6; 18 -4.445,4.6
SOIC8_150MIL = smd 0.6 x 2.2: 1 -1.905,-2.6; 2 -0.635,-2.6; 3 0.635,-2.6; 4 1.905,-2.6; 5 1.905,2.6; 6 0.635,2.6; 7 -0.635,2.6; 8 -1.905,2.6
S6B-PH-SM4_TB = smd 1 x 2.6: 1 5.46,9.68; 2 7.46,9.68; 3 9.46,9.68; 4 11.46,9.68; 5 13.46,9.68; 6 15.46,9.68 | smd 1 x 3: GND 2.476,3.88; GND2 18.444,3.88
SOT23-3 = smd 0.8 x 0.9: 1 -0.95,-1; 2 0.95,-1; 3 0,1.1
SOT23-R = smd 0.635 x 1.016: 1 -0.95,-1; 2 0.95,-1; 3 0,1
0603-RES = smd 1.1 x 1: 1 -0.85,0; 2 0.85,0
0603 = smd 1.1 x 1: 1 -0.85,0; 2 0.85,0
RESPACK_4X0603 = smd 0.45 x 0.9: 1 -1.3,-0.85; 2 -0.4,-0.85; 3 0.4,-0.85; 4 1.3,-0.85; 5 1.3,0.85; 6 0.4,0.85; 7 -0.4,0.85; 8 -1.3,0.85
SOLDERJUMPER_CLOSEDWIRE = smd 1.168 x 1.6: 1 -0.762,0; 2 0.762,0 | smd 0.635 x 0.203: WIRE 0,0
BUZZER-12MM = drill 0.9 pad 1.778: + 3.25,0; - -3.25,0
BTN_KMR2_4.6X2.8 = smd 0.9 x 0.9: A 2.05,0.8; A' -2.05,0.8; B 2.05,-0.8; B' -2.05,-0.8
TSSOP24 = smd 0.305 x 0.991: 1 -3.575,-2.918; 2 -2.925,-2.918; 3 -2.275,-2.918; 4 -1.625,-2.918; 5 -0.975,-2.918; 6 -0.325,-2.918; 7 0.325,-2.918; 8 0.975,-2.918; 9 1.625,-2.918; 10 2.275,-2.918; 11 2.925,-2.918; 12 3.575,-2.918; 13 3.575,2.918; 14 2.925,2.918; 15 2.275,2.918; 16 1.625,2.918; 17 0.975,2.918; 18 0.325,2.918; 19 -0.325,2.918; 20 -0.975,2.918; 21 -1.625,2.918; 22 -2.275,2.918; 23 -2.925,2.918; 24 -3.575,2.918
SOT23-5 = smd 0.55 x 1.2: 1 -0.95,-1.3; 2 0,-1.3; 3 0.95,-1.3; 4 0.95,1.3; 5 -0.95,1.3
MICROSD = smd 0.7 x 1.5: 1 9,-10.64; 2 7.9,-10.24; 3 6.8,-10.64; 4 5.7,-11.04; 5 4.6,-10.64; 6 3.5,-11.04; 7 2.4,-10.64; 8 1.3,-10.64 | smd 1.8 x 1.4: CD1 2,-0.44; CD2 8,-0.44 | smd 1.4 x 1.9: MT1 0.4,-13.54; MT2 13.6,-14.44
WROOM32_SKINNY = smd 1.2 x 0.9: 1 -8.5,5; 2 -8.5,3.73; 3 -8.5,2.46; 4 -8.5,1.19; 5 -8.5,-0.08; 6 -8.5,-1.35; 7 -8.5,-2.62; 8 -8.5,-3.89; 9 -8.5,-5.16; 10 -8.5,-6.43; 11 -8.5,-7.7; 12 -8.5,-8.97; 13 -8.5,-10.24; 14 -8.5,-11.51; 25 8.5,-11.51; 26 8.5,-10.24; 27 8.5,-8.97; 28 8.5,-7.7; 29 8.5,-6.43; 30 8.5,-5.16; 31 8.5,-3.89; 32 8.5,-2.62; 33 8.5,-1.35; 34 8.5,-0.08; 35 8.5,1.19; 36 8.5,2.46; 37 8.5,3.73; 38 8.5,5 | smd 0.9 x 1.2: 15 -5.7,-12.9; 16 -4.43,-12.9; 17 -3.16,-12.9; 18 -1.89,-12.9; 19 -0.62,-12.9; 20 0.65,-12.9; 21 1.92,-12.9; 22 3.19,-12.9; 23 4.46,-12.9; 24 5.73,-12.9 | smd 6 x 6: P$1 0.34,-2.7
4UCONN_20329_V2 = smd 1 x 2: BASE@1 -0.75,-2; BASE@2 0.75,-2 | smd 0.4 x 1.35: D+ 0,0.775; D- -0.65,0.775; GND 1.3,0.775; ID 0.65,0.775; VBUS -1.3,0.775 | drill 0.8 pad 1.143 offset: SPRT@1 -3.3,0.9; SPRT@2 3.3,0.9 | drill 0.9 pad 2.413 square: SPRT@3 -3.6,-1.9; SPRT@4 3.6,-1.9 | hole 0.7: -1.95,0; 1.95,0
CRYSTAL_8X3.8 = smd 1.3 x 1.9: P$1 -2.75,-1.6; P$2 2.75,-1.6; P$3 2.75,1.6; P$4 -2.75,1.6

### Placement (x,y rotation side)
A3  29.77,33.53 270 bottom
A4  29.26,25.4 0 bottom
A5  34.34,25.4 0 bottom
AUX_DIGITAL1  1.32,66.04 270 top
AUX_DIGITAL2  1.35,54.48 90 bottom
AUX_PWM  51.26,78.38 270 bottom
B1  31.8,48.26 270 top
C1  24.18,63.5 90 top
C2  12.75,67.31 90 top
C3  20.37,30.48 270 top
C4  39.42,69.85 180 top
C5  40.69,36.83 270 top
C6  27.99,58.42 270 top
C7  25.2,57.15 90 top
C8  39.42,57.15 90 top
C9  20.37,34.29 90 top
D3  40.69,5.08 0 top
D4  38.15,67.31 0 top
I2C_AUX2  50.85,52.07 90 top
I2C_HUD  50.88,64.64 270 bottom
I2C_OLED  50.85,67.31 90 top
IC1  34.34,72.39 270 top
IC2  19.1,45.72 0 bottom
IC3  16.56,27.94 180 top
LASER_DISX1  50.85,6.35 90 top
LASER_DISX2  50.85,18.92 270 bottom
LASER_DISX3  50.85,21.59 90 top
LASER_DISX4  50.93,34.21 270 bottom
LASER_DISX5  50.85,36.83 90 top
LASER_DISX6  50.85,49.38 270 bottom
LIMITSWITCH1  1.32,80.01 270 top
LIMITSWITCH2  1.35,68.43 90 bottom
PNEUMATIC  0.05,33.73 90 bottom
Q1  27.99,68.58 270 top
Q2  27.99,72.39 270 top
Q3  29.26,64.77 0 top
R1  34.34,15.24 270 bottom
R2  24.18,72.39 180 top
R3  24.18,15.24 270 bottom
R4  21.64,44.45 270 top
R5  27.99,36.83 90 bottom
R6  20.37,30.48 90 bottom
R7  39.42,62.23 270 top
R8  24.18,30.48 90 bottom
R9  27.99,30.48 270 bottom
R10  34.34,8.89 270 bottom
R11  24.18,36.83 90 bottom
R12  17.83,78.74 270 top
R13  17.83,67.31 90 top
R14  20.37,36.83 270 bottom
R15  24.18,68.58 0 top
R17  7.92,5.08 0 top
SCLPU  31.8,21.59 0 bottom
SDAPU  26.72,21.59 0 bottom
SG1  17.83,57.15 0 top
SJ1  14.02,13.97 0 bottom
SW2  16.56,73.66 0 top
TO_ELE_DIS  0.05,54.61 270 top
TO_STM32  1.32,34.29 270 top
TO_SUPER_CAP  1.32,22.68 90 bottom
U1  34.67,33.1 90 top
U2  33.07,60.96 90 top
X1  16.56,20.32 270 top
X2  29.26,12.7 180 top
X4  25.45,77.47 180 top
Y1  16.56,38.1 90 top

### Tracks (layer width: path | path; a pad name or v marks a point on that pad's centre or on a via)
0SCL
  Top 0.305: LASER_DISX1.2 42.58,11.62 40.01,14.19 40.01,30.94 38.89,32.05 37.65,32.05 U1.5
0SDA
  Top 0.305: LASER_DISX1.1 42.58,9.62 39.18,13.01 39.18,24.62 39.17,24.64 39.17,30.99 38.66,31.5 38.63,31.47 U1.4
1SCL  (via drill 0.35)
  Top 0.305: U1.7 38.48,33.42 v38.62,33.28
  Route15 0.305: v38.62,33.28 38.62,17.26 v41.26,14.62
  Bottom 0.305: v41.26,14.62 42.22,13.65 LASER_DISX2.2
1SDA  (via drill 0.35)
  Top 0.305: v36.16,32.77 U1.6
  Bottom 0.305: LASER_DISX2.1 42.95,22.64 41.32,24.27 41.32,26.59 36.16,31.75 v36.16,32.77
2RX  (via drill 0.35)
  Top 0.203: X2.27 21.56,21.67 v22.28,20.95 | v9.58,25.35 9.85,25.62 11.05,25.62 11.26,25.83 11.26,28.96
  Top 0.254: 11.26,28.96 11.26,29.09 9.87,30.48 TO_STM32.1
  Route15 0.203: v22.28,20.95 21.01,19.68 15.24,19.68 v9.58,25.35
2SCL  (via drill 0.35)
  Top 0.305: LASER_DISX3.2 44.95,26.86 v45.14,26.67 | U1.9 39.22,34.72 v39.4,34.91
  Route15 0.305: v45.14,26.67 39.4,32.41 v39.4,34.91
2SDA
  Top 0.305: U1.8 39.64,34.07 40.69,33.02 40.69,26.04 41.87,24.86 LASER_DISX3.1
2TX  (via drill 0.35)
  Top 0.203: X2.28 19.66,20.4 v19.1,20.95 | TO_STM32.2 8.85,28.48 v7.67,27.3
  Route15 0.203: v19.1,20.95 12.75,27.3 v7.67,27.3
3SCL  (via drill 0.35)
  Top 0.305: U1.11 37.5,35.93 36.92,35.93 36.16,35.16 v36.16,34.29
  Bottom 0.305: LASER_DISX4.2 41.93,30.04 41.56,30.04 39.4,32.2 39.4,33.61 38.72,34.29 v36.16,34.29
3SDA  (via drill 0.35)
  Top 0.305: v38.91,36.32 38.49,35.9 38.49,35.7 38.16,35.37 U1.10
  Route15 0.305: v38.91,36.32 39.54,35.69 39.73,35.69 41.71,33.71 v41.71,32.26
  Bottom 0.305: LASER_DISX4.1 v41.71,32.26
4SCL  (via drill 0.35)
  Top 0.305: LASER_DISX5.2 37.46,42.1 v36.57,41.21 | U1.14 31.84,36.11 32.42,36.11 33.43,37.13 v33.43,38.07
  Route2 0.305: v36.57,41.21 v33.43,38.07
4SDA  (via drill 0.35)
  Top 0.305: LASER_DISX5.1 41.74,38.88 39.85,38.88 39.44,38.48 v38.05,38.48 | v32.41,37.34 32.41,37.33 U1.13
  Route2 0.305: v32.41,37.34 33.06,37.34 33.11,37.29 33.76,37.29 34.94,38.48 v38.05,38.48
5SCL  (via drill 0.35)
  Top 0.305: U1.16 31.84,34.63 32.42,34.63 33.01,34.04 v33.83,34.04
  Bottom 0.305: LASER_DISX6.2 41.86,43.01 41.48,43.01 34.11,35.64 34.11,34.98 33.83,34.7 v33.83,34.04
5SDA  (via drill 0.35)
  Top 0.305: U1.15 33.26,35.37 v33.32,35.31
  Bottom 0.305: LASER_DISX6.1 41.86,45.01 41.48,45.01 33.32,36.86 v33.32,35.31
A0  (via drill 0.35)
  Top 0.305: v37.39,28.7 37.39,29.32 U1.1
  Route2 0.305: v23.4,23.88 23.4,30.49 23.7,30.79 23.7,31.44 23.24,31.9 22.37,31.9 v21.75,32.51
  Route15 0.305: v37.39,28.7 36.47,28.7 35.73,29.44 31.87,29.44 29.59,27.16 26.68,27.16 v23.4,23.88
  Bottom 0.305: A5.1 37.39,27.43 v37.39,28.7 | R6.2 21.55,32.51 v21.75,32.51
A1  (via drill 0.35)
  Top 0.305: U1.2 36.92,30.17 v35.4,28.66
  Route2 0.305: v31.04,24.13 31.04,25.27 33.38,27.62 34.36,27.62 v35.4,28.66 35.15,28.66 36.19,29.7 36.44,29.7 36.9,30.16 36.9,30.8 36.44,31.27 32.54,31.27 v26.21,37.59
  Bottom 0.305: A4.1 31.04,24.64 v31.04,24.13 | R11.2 26.12,37.68 v26.21,37.59
A2  (via drill 0.35)
  Top 0.305: v29.77,35.56 30.53,34.8 30.53,32.26 30.85,31.94 30.85,31.8 31.18,31.47 U1.21
  Bottom 0.305: A3.1 v29.77,35.56 29.77,35.9 R5.2
A5_IO4  (via drill 0.35)
  Top 0.203: X2.26 21.09,22.61 v22.15,22.61
  Route2 0.203: v43.48,68.58 43.48,34.12 43.68,33.92 43.68,19 35.1,10.41 28.23,10.41 v25.29,13.35
  Route15 0.203: v25.29,13.35 25.29,16.58 25.55,16.84 25.55,19.35 24.48,20.42 24.34,20.42 v22.15,22.61
  Bottom 0.203: AUX_PWM.2 41.83,71.43 41.53,71.43 41.32,71.22 41.32,69.93 41.53,69.72 42.35,69.72 v43.48,68.58
A13_I35  (via drill 0.35)
  Top 0.203: X2.7 36.17,15.32 v35.61,15.88 | v26.09,11.43 24.82,12.7 v24.18,12.7
  Bottom 0.203: v35.61,15.88 34.56,15.88 R1.1 33.07,14.82 33.07,12.7 31.8,11.43 v26.09,11.43 | R3.2 v24.18,12.7
AUX_DIGITAL1  (via drill 0.35)
  Top 0.305: v20.46,52.7 17.29,55.88 15.14,55.88 15.12,55.85 14.04,55.85 14.02,55.88 v12.75,55.88 | v12.75,59.05 11.58,60.23 AUX_DIGITAL1.2
  Bottom 0.305: IC2.16 20.95,52.13 20.37,52.7 v20.46,52.7 | v12.75,59.05 v12.75,55.88
AUX_DIGITAL2  (via drill 0.35)
  Top 0.305: v20.46,54.61 16.02,59.05 v15.93,59.05
  Bottom 0.305: IC2.17 22.25,52.83 v20.46,54.61 | AUX_DIGITAL2.2 14.69,60.29 v15.93,59.05
BUZZER  (via drill 0.35)
  Top 0.203: X2.10 35.94,19.13 v35.86,19.05
  Route2 0.203: v26.47,32.77 26.47,22.35 v28.75,20.07
  Route15 0.203: SG1.+ 21.08,55.03 21.74,54.37 21.74,39.24 20.91,38.4 20.91,37.8 21.34,37.37 21.87,37.37 v26.47,32.77 | v28.75,20.07 29.77,19.05 v35.86,19.05
CAP_OR_BAT  (via drill 0.35)
  Top 0.305: TO_ELE_DIS.5 8.64,40.06 8.26,40.06 7.42,39.21 v7.42,38.35 | v37.73,26.41 37.73,24.24 X2.14
  Route15 0.305: v7.42,38.35 13.24,32.53 13.24,32.06 16.59,28.7 v17.58,28.7 | v37.73,26.41 37.73,26 37.42,25.68 36.2,25.68 35.03,24.51 35.03,23.3 v31.55,19.81
  Bottom 0.305: v17.58,28.7 20.88,25.4 20.88,20.32 22.91,18.29 30.02,18.29 v31.55,19.81
CHARGE_OR_NOT  (via drill 0.35)
  Top 0.305: X2.16 33.28,25.19 33.28,24.83 31.26,22.81 v28.71,22.81 | v25.45,36.9 20.12,42.23 20.12,44.2 18.85,45.47 v18.08,45.47 | TO_ELE_DIS.6 9.1,38.52 v9.1,38.06
  Route2 0.305: v28.71,22.81 27.74,23.78 27.74,27.08 28.27,27.61 28.27,28.27 27.74,28.8 27.74,33.53 25.45,35.81 v25.45,36.9 | v18.08,45.47 10.68,38.06 v9.1,38.06
CR1220  (via drill 0.35)
  Top 0.305: IC3.3 15.93,34.14 16.32,34.53 16.32,35.95 19.74,39.37 v20.37,39.37 | B1.+ 30.5,39.97 v29.9,39.37
  Route2 0.305: v20.37,39.37 v29.9,39.37
DTR  (via drill 0.35)
  Top 0.305: IC1.23 37,73.14 v37.52,73.66 | v26.29,72.33 26.19,72.24 Q2.2 25.04,69.49 24.31,69.49 23.41,68.58 R15.1
  Route2 0.305: v37.52,73.66 27.62,73.66 v26.29,72.33
EN  (via drill 0.35)
  Top 0.305: U2.3 33.87,61.91 33.14,61.18 v33.14,60.01 | v39.42,60.21 39.86,60.21 40.33,60.67 40.33,62.17 R7.1
  Route2 0.305: v33.14,60.01 39.22,60.01 v39.42,60.21
GND  (via drill 0.35)
  Top 0.305: 3.8,67.31 LIMITSWITCH1.GND2 6.78,72.2 LIMITSWITCH1.3 11.11,72.2 v11.56,71.75 | 3.8,67.31 AUX_DIGITAL1.GND | 9.41,58.42 AUX_DIGITAL1.3 9.54,58.17 v7.42,58.17 | AUX_DIGITAL1.GND2 3.93,55.12 3.93,53.98 | 3.93,53.98 TO_ELE_DIS.GND | 3.8,34.92 3.8,36.04 TO_ELE_DIS.GND2 3.93,33.59 TO_STM32.GND 3.8,34.92 | TO_STM32.3 6.62,23.5 TO_STM32.GND2 v3.8,22.23 3.8,20.7 X1.MT1 3.02,19.14 5,17.16 5.18,17.16 X1.6 | LIMITSWITCH1.GND 3.8,78.68 v2.59,77.47 | 3.8,67.31 v5.13,67.31 | 3.93,53.98 v4.5,53.98 | 3.8,34.92 v5.13,34.92 | X1.MT2 3.02,7.62 v3.86,7.62 | X2.38 22.2,7.7 v22.28,7.62 | X2.1 39.12,7.7 v39.63,7.19 D3.C | LASER_DISX1.GND 48.46,6.35 v45.77,6.35 | LASER_DISX1.4 44.88,15.62 v45.14,15.88 | 48.75,20.32 LASER_DISX1.GND2 v46.62,18.6 | 48.75,20.32 LASER_DISX3.GND | 48.75,20.32 v49.58,20.32 | LASER_DISX5.4 45.77,46.1 LASER_DISX5.GND2 v48.75,50.8 I2C_AUX2.GND | I2C_AUX2.4 45.93,64.32 I2C_AUX2.GND2 v48.75,66.04 I2C_OLED.GND | I2C_OLED.4 44.75,76.58 v46.15,77.98 47.73,79.56 I2C_OLED.GND2 | U2.2 v35.61,60.96 | C8.2 38.55,57.23 38.5,57.23 38.26,56.99 38.26,56.94 37.18,55.86 v35.61,55.86 B1.- 29.6,55.86 C6.2 25.73,57.47 C7.2 | C1.2 25.38,64.45 v25.7,64.77 | C2.2 13.39,68.89 v13.39,69.85 | SW2.A' 14.35,74.3 v13.39,74.3 | C4.2 38.79,70.06 v38.79,71.12 | C5.2 v42.95,33.62 LASER_DISX3.4 45.77,30.86 v46.53,31.62 LASER_DISX3.GND2 LASER_DISX6.GND2 | U1.12 38.15,37.23 v38.15,37.47 | IC3.4 14.66,31.75 v14.02,32.38 | C3.2 21.33,28.57 v22.28,28.57 | C9.2 20.69,35.24 v21.64,36.2 | TO_ELE_DIS.4 9.07,43.81 v7.67,43.81 | IC1.THERM 35.09,73.14 IC1.2 35.09,74.92 v35.99,75.82 | X2.P$1 27.18,17.14 v24.82,17.14 | X4.SPRT@4 24.6,79.37 X4.BASE@2 X4.BASE@1 27.43,79.47 27.53,79.37 X4.SPRT@3 29.05,76.87 X4.SPRT@1
  Top 0.305: X4.SPRT@4 21.85,76.87 X4.SPRT@2 20.04,74.46 SW2.A 21.92,74.46 X4.GND | X4.SPRT@4 18.05,79.37 R12.1 | SG1.- 15.04,57.15 v15.8,57.91 | X2.15 35.82,25.6 v36.53,24.9
  Bottom 0.305: R3.1 24.82,16.73 v24.82,17.14 | v14.02,32.38 12.13,30.49 TO_SUPER_CAP.3 | v46.62,18.6 46.65,18.64 LASER_DISX2.GND | LASER_DISX2.4 40.49,7.19 v39.63,7.19 | PNEUMATIC.6 8.64,48.1 8.26,48.1 7.67,47.51 v7.67,43.81 | IC2.9 13.41,41.15 v13.41,43.18 | R11.1 v26.72,35.98 R5.1 | IC2.3 IC2.4 IC2.5 18.47,43.01 v18.9,43.45 | v42.95,33.62 LASER_DISX6.4 | LASER_DISX4.4 45.84,24.94 LASER_DISX4.GND2 48.83,21.07 v49.58,20.32 | AUX_PWM.3 45.96,67.59 AUX_PWM.GND2 | AUX_PWM.GND 46.57,77.56 v46.15,77.98 | I2C_HUD.4 42.95,55.4 40.37,55.4 39.91,54.94 39.91,54.28 40.37,53.83 47.34,53.83 I2C_HUD.GND2 I2C_AUX2.GND v48.75,50.8 LASER_DISX6.GND | AUX_DIGITAL2.GND2 6.81,62.29 AUX_DIGITAL2.3 8.53,61.2 8.16,61.2 7.42,60.46 v7.42,58.17 | LASER_DISX6.GND2 48.75,34 LASER_DISX4.GND 48.83,32 v49.07,31.75 | I2C_HUD.GND AUX_PWM.GND2 | AUX_PWM.GND2 48.78,68.88 v48.56,69.09 | LIMITSWITCH2.3 11.12,76.24 11.23,76.35 12.14,76.35 v13.03,75.46 | PNEUMATIC.GND 3.8,36.08 TO_SUPER_CAP.GND2 3.8,32.96 v2.84,32 | LIMITSWITCH2.GND2 2.59,77.99 v2.59,77.47 | LIMITSWITCH2.GND 5.13,67.95 v5.13,67.31 | AUX_DIGITAL2.GND 4.5,54.64 v4.5,53.98 4.5,52.74 PNEUMATIC.GND2 | TO_SUPER_CAP.GND v3.8,22.23 | LASER_DISX2.GND2 48.43,6.35 v45.77,6.35 | R6.1 21.43,28.57 v22.28,28.57
  pour Route15: 0.05,81.92 0.05,0 19.35,0 19.35,5.35 arc-90 20.86,6.86 37.4,6.86 arc-90 38.91,5.35 38.91,0 51.49,0 51.49,81.92
GPIO0  (via drill 0.35)
  Top 0.305: Q2.3 30.25,71.23 v30.25,69.85 | X2.25 22.07,24.21 v22.15,24.13
  Route15 0.305: v30.25,69.85 30.25,60.52 29.75,60.02 29.75,40.63 30.68,39.7 30.68,32.66 v22.15,24.13
LIMITSWITCH1  (via drill 0.35)
  Top 0.305: v16.56,72.86 15.29,71.59 14.06,71.59 11.45,74.2 LIMITSWITCH1.2 8.89,74.2 v7.89,73.19
  Bottom 0.305: IC2.14 18.41,58.32 7.92,68.8 7.92,73.16 v7.89,73.19
LIMITSWITCH2
  Bottom 0.305: LIMITSWITCH2.2 10.19,74.24 19.68,64.75 IC2.15
MISO  (via drill 0.35)
  Top 0.203: X2.31 19.18,16.59 v19.1,16.51 | X1.7 7.53,17.92 v7.67,17.78
  Route15 0.203: v19.1,16.51 8.94,16.51 v7.67,17.78
MOSI  (via drill 0.35)
  Top 0.203: X2.30 21.56,17.86 v22.28,17.14 | X1.3 7.22,13.52 v7.67,13.97
  Route15 0.203: v22.28,17.14 19.1,13.97 v7.67,13.97
N$1  (via drill 0.35)
  Top 0.305: IC3.1 18.99,31.06 v18.99,33.02 | Y1.P$4 14.02,34.41 v14.02,33.66
  Route2 0.305: v18.99,33.02 14.66,33.02 v14.02,33.66
N$2  (via drill 0.35)
  Top 0.305: IC1.3 34.59,75.7 34.09,76.2 v33.58,76.2 | X4.D+ v25.45,74.68
  Route2 0.305: v33.58,76.2 32.81,75.44 31.81,75.44 30.79,74.42 25.7,74.42 v25.45,74.68
N$3
  Top 0.305: IC3.2 17.76,31.1 17.76,31.81 18.16,32.21 Y1.P$1
N$4  (via drill 0.35)
  Top 0.305: C3.1 21.33,31.43 v21.89,30.86 | v19.1,23.5 19.1,24.7 IC3.8 | R4.2 25.31,39.93 v25.31,38.47
  Route2 0.305: v21.89,30.86 21.89,31.26 20.86,32.3 20.86,34.01 v25.31,38.47
  Route15 0.305: v21.89,30.86 19.1,28.07 v19.1,23.5
N$5  (via drill 0.35)
  Top 0.305: D3.A 39.84,4.03 v39.42,4.45
  Route15 0.305: v39.42,4.45 36.88,6.99 v35.61,6.99
  Bottom 0.305: R10.2 35.4,6.99 v35.61,6.99
N$6
  Top 0.305: X4.D- 26.1,75.55 26.82,75.55 27.31,75.06 27.96,75.06 28.41,75.51 33.16,75.51 33.47,75.2 33.86,75.2 34.09,74.96 IC1.4
N$7
  Top 0.305: Q3.2 27.99,61.55 C6.1 28.46,58.91 33.27,58.91 U2.1 38.05,60.01 R7.2 36.3,64.5 D4.C
N$8  (via drill 0.35)
  Top 0.305: v27.48,27.94 26.97,28.45 v24.69,28.45
  Bottom 0.305: SCLPU.2 28.4,24.23 27.81,24.23 27.46,24.58 27.46,26.22 27.48,26.24 v27.48,27.94 | R8.1 24.18,28.96 v24.69,28.45
N$9  (via drill 0.35)
  Top 0.305: v22.91,31.11 22.91,36.83 v21.64,38.1
  Bottom 0.305: SDAPU.2 24.74,22.81 24.74,27.22 22.91,29.05 v22.91,31.11 | R14.1 20.79,38.1 v21.64,38.1
N$10  (via drill 0.35)
  Top 0.305: v36.12,30.48 36.46,30.82 U1.3
  Route2 0.305: v28.96,28.75 29.51,28.19 33.83,28.19 v36.12,30.48
  Bottom 0.305: R9.2 28.87,28.75 v28.96,28.75
N$12
  Top 0.305: R15.2 25.98,69.53 Q1.1
N$13
  Top 0.305: R2.2 24.28,73.34 Q2.1
ONBOARD_LED  (via drill 0.35)
  Top 0.305: X2.13 37,22.94 35.98,23.96 v35.82,23.96
  Route2 0.203: v35.82,23.96 35.82,19.97 35.18,19.33 35.18,16.99 34.52,16.33 34.52,15.42 34.59,15.35 v34.59,11.68
  Bottom 0.203: R10.1 34.59,9.99 v34.59,11.68
PNEU_1  (via drill 0.35)
  Route2 0.305: v13.79,48.56 13.79,46.76 v7.67,40.64
  Bottom 0.305: IC2.10 13.79,49.85 v13.79,48.56 | PNEUMATIC.2 8.22,41.19 v7.67,40.64
PNEU_2
  Bottom 0.305: IC2.11 14.6,51.02 13.79,51.83 9.99,51.83 6.89,48.72 6.89,43.49 7.35,43.03 9.57,43.03 PNEUMATIC.3
PNEU_3
  Bottom 0.305: IC2.12 15.87,51.02 14.51,52.38 9.76,52.38 6.33,48.95 6.33,43.26 7.3,42.28 11.2,42.28 11.44,42.52 11.44,43.86 10.11,45.19 PNEUMATIC.4
PNEU_4
  Bottom 0.305: PNEUMATIC.5 14.71,47.19 17.14,49.62 IC2.13
RESET  (via drill 0.35)
  Top 0.203: SW2.B 17.81,73.66 v17.58,73.66 | SW2.B' 14.09,73.28 v13.51,73.28 | SW2.B 15.04,69.29 15.04,68.33 15.54,67.82 16.87,67.82 R13.6 | SW2.B 18.61,70.59 21.48,67.72 25.73,67.72 26.58,68.58 Q1.3 29.09,69.51 v29.01,69.6 | X2.3 37.25,10.76 37.03,10.76 35.61,12.18 v35.61,13.46 | v41.98,68.58 43.12,69.72 45.41,69.72 45.87,70.18 45.87,71.89 44.38,73.39 41.52,73.39 40.79,72.65 40.79,70.37 C4.1 39.06,68.64 v36.63,68.64
  Route2 0.203: v17.58,73.66 13.89,73.66 v13.51,73.28 | v35.61,13.46 35.61,14.91 34.93,15.59 34.93,16.16 40.54,21.77 40.54,53.42 41.42,54.31 41.42,54.91 40.25,56.08 40.25,59.43 40.56,59.74 40.56,67.16 v41.98,68.58
  Route15 0.203: v36.63,68.64 33.52,68.64 31.55,70.61 29.77,70.61 29.01,69.85 v29.01,69.6
RTS  (via drill 0.35)
  Top 0.305: R2.1 25.7,71.72 25.7,71.12 v25.63,71.19 | Q1.2 28.42,67.63 v28.5,67.55 | IC1.19 37.13,70.35 v37.13,70.1
  Route2 0.305: v25.63,71.19 25.63,70.41 v28.5,67.55
  Bottom 0.305: v37.13,70.1 36.46,69.43 33.76,69.43 31.36,67.03 30.71,67.03 30.2,67.55 v28.5,67.55
RX_CUS  (via drill 0.35)
  Top 0.203: X2.12 24.35,21.67 v23.16,22.86
  Route15 0.203: v23.16,22.86 22.86,22.86 22.43,23.29 20.04,23.29 v19.1,22.35
  Bottom 0.305: v19.1,22.35 13.74,22.35 TO_SUPER_CAP.1
RXD0  (via drill 0.35)
  Top 0.203: v38.79,74.3 38.5,74.3 38.25,74.05 38.25,73.36 37.04,72.14 IC1.21 | X2.34 20.68,12.7 v19.1,12.7
  Route2 0.203: v38.79,74.3 38.25,73.76 38.25,72.64 21.24,55.63 20.45,55.63 19.64,54.82 19.64,39.07 19.83,38.87 19.83,16.28 19.1,15.54 v19.1,12.7
SCK  (via drill 0.35)
  Top 0.203: X1.5 4.02,15.72 v3.86,15.88 | X2.29 19.82,19.13 v19.1,18.41
  Route15 0.203: v19.1,18.41 8,18.41 7.95,18.46 6.45,18.46 v3.86,15.88
SCL  (via drill 0.35)
  Top 0.203: I2C_OLED.3 42.16,73.79 41.36,73.79 41.22,73.66 v40.69,73.66 | v22.4,66.8 22.35,66.75
  Top 0.305: v21.94,8.97 21.94,9.34 | 21.94,9.34 21.04,10.24 X2.36 20.48,10.24 18.06,12.66 18.06,22.5 15.93,24.64 IC3.6 15.93,26.05 16.82,26.94 30.39,26.94 35.37,31.92 35.37,41.56 47.06,53.25 47.06,56.41 44.14,59.34 I2C_AUX2.3 | 22.35,66.75 8.02,52.43 8.02,46.55 8.07,46.5 | 21.94,9.34 23.06,8.22 23.06,7.29 22.6,6.83 19.25,6.83 11.83,14.25 11.83,43.43 10.11,45.15 TO_ELE_DIS.3 9.43,45.15 8.07,46.5 | U1.22 30.42,30.82 13.23,48.01 8.28,48.01 8.07,47.8 8.07,46.5
  Route15 0.203: v40.69,73.66 38.88,71.85 30.3,71.85 28.55,70.1 28.5,70.1 25.2,66.8 v22.4,66.8
  Bottom 0.305: I2C_HUD.3 42.2,56.6 39.69,56.6 24.21,41.12 IC2.1 26.18,41.12 31.85,35.44 31.85,24.7 32.56,23.99 SCLPU.1 32.56,19.59 v21.94,8.97
SD_CS  (via drill 0.35)
  Top 0.305: v7.7,12.42 X1.2 6.5,12.42 7.42,11.5 7.42,5.42 R17.1
  Bottom 0.305: SJ1.2 11.71,12.42 v7.7,12.42
SD_CS_MCU  (via drill 0.35)
  Top 0.203: X2.9 37.25,17.34 36.11,17.34 33.07,14.3 33.07,10.79 32.44,10.16 25.45,10.16 22.28,13.34 v22.28,14.61
  Bottom 0.203: SJ1.1 21.64,13.97 v22.28,14.61
SDA  (via drill 0.35)
  Top 0.305: X2.37 19.46,8.97 17.22,11.21 17.22,22.14 14.66,24.71 IC3.5 | TO_ELE_DIS.2 10.03,47.15 12.63,44.55 12.63,27.37 IC3.5 | IC3.5 14.66,25.97 16.36,27.68 22.49,27.68 24.99,30.17 U1.23 32.25,30.17 34.67,32.59 34.67,42.44 46.56,54.33 46.56,56.2 45.42,57.34 I2C_AUX2.2 | v41.07,57.34 I2C_AUX2.2 | I2C_OLED.2 42.58,72.58 41.24,71.25 41.24,58.74 42.65,57.34 I2C_AUX2.2
  Bottom 0.305: SDAPU.1 27.48,23.36 26.09,24.75 26.09,31.34 22.89,34.54 22.89,40.51 IC2.2 22.28,45.23 36.41,59.37 I2C_HUD.2 42.67,59.37 41.07,57.77 v41.07,57.34
TX_CUS  (via drill 0.35)
  Top 0.203: v21.89,25.65 22.91,24.64 24.18,24.64 v25.7,23.11 | X2.11 37.43,20.07 32.33,20.07 31.65,20.75 28.47,20.75 27.79,20.07 v27.48,20.07
  Route2 0.203: v27.48,20.07 25.7,21.84 v25.7,23.11
  Bottom 0.203: TO_SUPER_CAP.2 15.33,28.49 16.56,29.72 17.83,29.72 v21.89,25.65
TXD0  (via drill 0.35)
  Top 0.203: v39.85,74.5 39.47,74.12 39.47,74 37.11,71.64 IC1.20 | X2.35 21.72,11.51 v22.28,12.06
  Route2 0.203: v39.85,74.5 39.85,60.82 40.15,60.51 40.15,59.91 39.85,59.6 39.85,35.5 40.13,35.21 40.13,29.92 v22.28,12.06
VBAT  (via drill 0.35)
  Top 0.305: v24.18,19.68 25.06,18.81 32.09,18.81 33.64,17.26 v34.34,17.26 | TO_ELE_DIS.1 11.41,49.15 v11.66,48.9 14.34,51.57 20.43,51.57 22.77,53.91 22.77,64.99 23.56,65.77 Q3.3
  Route15 0.305: v11.66,48.9 11.66,37.65 v10.85,36.83
  Bottom 0.305: v24.18,19.68 24.18,24.74 20.25,28.67 19.7,28.67 19.46,28.91 19.46,29.46 9.88,39.04 | PNEUMATIC.1 9.88,39.04 | v34.34,17.26 34.57,17.03 35.56,17.03 36.4,16.2 36.4,15.55 35.94,15.09 35.04,15.09 R1.2 | v10.85,36.83 9.88,37.79 9.88,39.04
VBUS  (via drill 0.35)
  Top 0.305: R12.2 19.74,75.98 v19.74,75.56 | X4.VBUS 27.6,75.84 v27.63,75.84 | IC1.8 31.3,73.14 v31.04,72.88 v31.04,67.82 | Q3.1 27.5,63.77 v27.23,63.5 | D4.A v38.15,67.31
  Route2 0.305: v31.04,67.82 27.23,64.01 v27.23,63.5
  Route15 0.305: v27.63,75.84 30.6,72.88 v31.04,72.88 | v38.15,67.31 31.55,67.31 v31.04,67.82
  Bottom 0.305: v19.74,75.56 20.35,75.56 20.4,75.51 27.3,75.51 v27.63,75.84
VCC  (via drill 0.35)
  Top 0.305: R17.2 v14.02,5.08 | X1.4 7.05,14.62 v7.67,15.24 | X2.2 39.34,8.97 v39.42,8.89 | LASER_DISX1.3 43.3,13.97 v45.77,13.97 | LASER_DISX3.3 45.42,28.86 v45.77,29.21 | LASER_DISX5.3 43.3,44.45 v45.77,44.45 | C5.1 41.7,37.78 v42.06,37.41 | I2C_AUX2.1 43.49,55.88 v45.77,55.88 | C8.1 39.42,55.88 v40.69,54.61 | U2.5 31.45,59.69 v30.53,59.69 | C1.1 25.38,62.55 v25.7,62.23 | C7.1 25.62,55.88 v26.72,55.88 | C2.1 14.21,66.36 v14.53,66.04 | R13.3 19.97,67.71 v20.37,67.31 | AUX_DIGITAL1.1 10.24,62.87 v11.56,62.87 | LIMITSWITCH1.1 10.24,75.56 v11.56,75.56 | IC1.6 33.54,74.39 | IC1.7 32.34,74.44 v32.13,74.65 32.83,74.65 IC1.6 | I2C_OLED.1 43.05,70.48 v45.14,70.48 | R4.1 21.01,45.94 v21.01,46.35 | C9.1 21.58,33.34 v21.89,33.66 | U1.24 31.44,29.21 v30.53,29.21 | IC1.5 IC1.6
  Route15 0.305: v30.53,29.21 33.66,32.34 v33.66,32.69 | v28.37,34 27.25,32.88 27.25,32.44 25.99,31.18 v25.14,31.18
  Bottom 0.305: LIMITSWITCH2.1 8.94,71.55 v8.94,71.07 | AUX_DIGITAL2.1 9.63,57.15 v9.58,57.1 | LASER_DISX2.3 44.72,11.65 v45.14,12.06 | LASER_DISX4.3 43.5,26.94 v45.77,29.21 | LASER_DISX6.3 43.43,42.11 v45.77,44.45 | I2C_HUD.1 44.07,60.28 44.44,60.28 45.77,58.95 v45.77,55.88 45.77,55.79 44.44,54.47 40.83,54.47 v40.69,54.61 | AUX_PWM.1 44.07,73.48 44.45,73.48 45.14,72.79 v45.14,70.48 | A5.2 33.32,26.45 v33.71,26.83 | A4.2 28.24,26.92 v30.53,29.21 30.11,29.21 R9.1 28.59,31.33 A3.2 | IC2.6 17.76,40.56 17.76,38.67 20.37,36.05 R14.2 20.37,35.18 v21.89,33.66 21.89,33.62 R8.2 24.33,31.18 v25.14,31.18 | IC2.18 23.55,48.9 v21.01,46.35
  pour Route2: 0.05,82.55 0.05,0 19.35,0 19.35,5.35 arc-90 20.86,6.86 37.4,6.86 arc-90 38.91,5.35 38.91,0 50.85,0 50.85,82.55

### Text on the board
tNames: ROBOMASTER CONTROLLER / V3.1 BY CHENGMING ZHANG / 4.1.2019.2AM / 4 LAYER / 7.16,2019.9PM / 4 LAYER